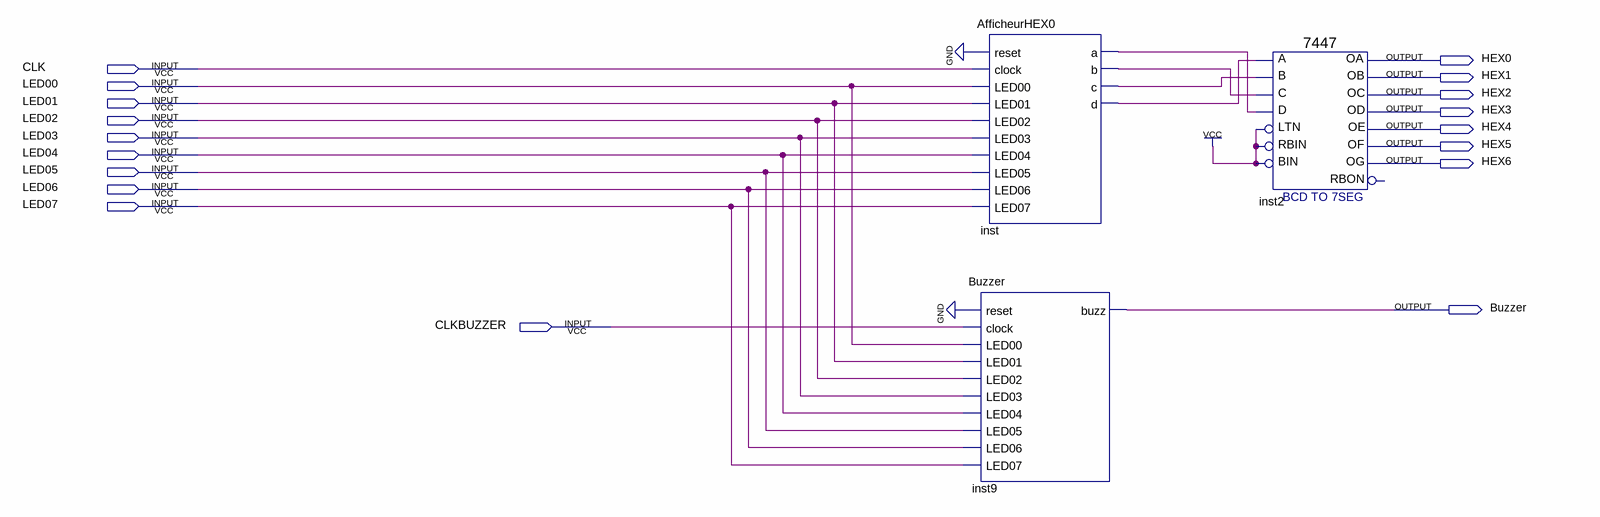
[diagram p0: schematic sheet]
// Quartus schematic HEX.bdf as structural Verilog: 3 symbols, 18 pins
module HEX (
  input  CLK,
  input  LED00,
  input  LED01,
  input  LED02,
  input  LED03,
  input  LED04,
  input  LED05,
  input  LED06,
  input  LED07,
  input  CLKBUZZER,
  output HEX0,
  output HEX1,
  output HEX2,
  output HEX3,
  output HEX4,
  output HEX5,
  output HEX6,
  output Buzzer
);

  wire inst_a, inst_b, inst_c, inst_d;

  AfficheurHEX0 inst (
    .reset(1'b0), .clock(CLK), .LED00(LED00), .LED01(LED01), .LED02(LED02), .LED03(LED03), .LED04(LED04),
    .LED05(LED05), .LED06(LED06), .LED07(LED07), .a(inst_a), .b(inst_b), .c(inst_c), .d(inst_d));
  Buzzer inst9 (
    .reset(1'b0), .clock(CLKBUZZER), .LED00(LED00), .LED01(LED01), .LED02(LED02), .LED03(LED03),
    .LED04(LED04), .LED05(LED05), .LED06(LED06), .LED07(LED07), .buzz(Buzzer));
  \7447  inst2 (
    .LTN(1'b1), .B(inst_c), .C(inst_b), .D(inst_a), .RBIN(1'b1), .BIN(1'b1), .A(inst_d), .OB(HEX1),
    .OC(HEX2), .OE(HEX4), .OD(HEX3), .OF(HEX5), .OG(HEX6), .OA(HEX0));  // open: RBON
endmodule
